# Altium schematic sheet HBridges.SchDoc
size A; Organization: Underwater Robotics; Address1: c/o Student Involvement; Address2: Campus Box 7306; Address3: 2016 Cates Ave. Raleigh, NC 27695; Revision: A1; SheetNumber: 4F; SheetTotal: 5F
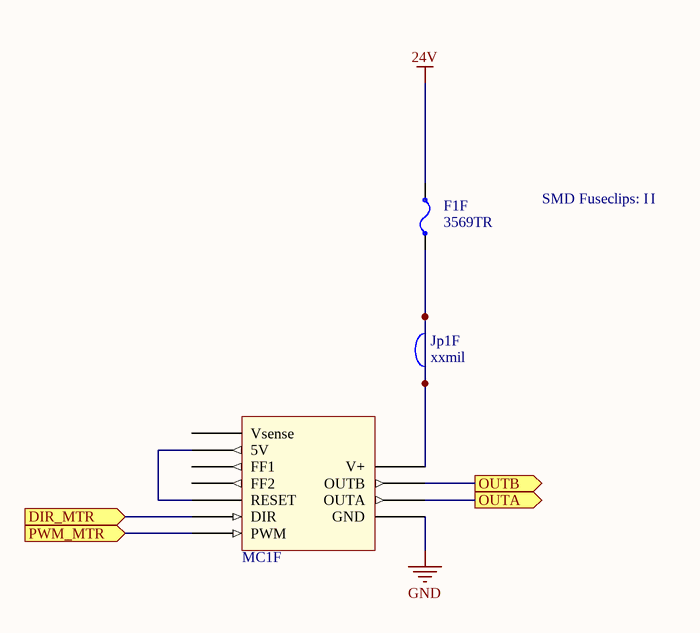
[diagram p0: HBridges.SchDoc]

## Parts
F1F  3569TR  [Horizontal SMD fuse clip]
i10F  3569TR (Placeholder)  (value not drawn)
i11F  3569TR (Placeholder)  (value not drawn)
Jp1F  value xxmil  [Jumper, 12AWG, 0.6"]  (hidden comment: Jumper)
MC1F  Motor Controller  [Pololu 24v12]  (value not drawn)

## Ports
DIR_MTR (in), OUTA (out), OUTB (out), PWM_MTR (in)

## Nets
24V: F1F.1
GND: MC1F.GND
DIR_MTR: MC1F.DIR ; port DIR_MTR
OUTA: MC1F.OUTA ; port OUTA
OUTB: MC1F.OUTB ; port OUTB
PWM_MTR: MC1F.PWM ; port PWM_MTR
NetF1F_2: F1F.2 Jp1F.1 Jp1F.2 MC1F.V+
NetMC1F_5V: MC1F.5V MC1F.RESET

Not connected (* = marked no-connect by the designer): MC1F FF1 FF2 V+_SENSE(Vsense)

## Notes on the sheet
- Title
- Size:
- Date:
- A
- Number:
- Time:
- Revision:
- Sheet
- of
- File:
- (in symbol 3569TR (Placeholder)) SMD Fuseclips: I; I

## Library data of the parts
F1F = 3569TR: Fuse Clip Assembly; Manufacturer 1: KEYSTONE; Subassembly: Yes; Description 1: KEYSTONE - 3569TR - FUSE CLIP, AUTO BLADE, SMT; Supplier 1: Newark; Supplier Part Number 1: 24T5056; RoHS: YES; Stock 1: 1000; Pricing 1: 1=0.798, 50=0.672, 100=0.644, 250=0.589, 500=0.566, 1000=0.491, 2500=0.427, 5000=0.413 (USD); ComponentLink1URL: http://www.farnell.com/datasheets/1703973.pdf; ComponentLink1Description: http://www.farnell.com/datasheets/1703973.pdf; Manufacturer Part Number: 3569TR
i10F i11F = 3569TR (Placeholder): Fuse Clip; Manufacturer 1: KEYSTONE; Subassembly: Yes; Description 1: KEYSTONE - 3569TR - FUSE CLIP, AUTO BLADE, SMT; Supplier 1: Newark; Supplier Part Number 1: 24T5056; RoHS: YES; Stock 1: 1000; Pricing 1: 1=0.798, 50=0.672, 100=0.644, 250=0.589, 500=0.566, 1000=0.491, 2500=0.427, 5000=0.413 (USD); ComponentLink1URL: http://www.farnell.com/datasheets/1703973.pdf; ComponentLink1Description: http://www.farnell.com/datasheets/1703973.pdf; Manufacturer Part Number: 3569TR
Jp1F = Jump: Resistor
MC1F = Pololu 24v12: Pololu 24v12 Motor Driver; Supplier 1: Pololu; Supplier Part Number 1: 24v12